# EAGLE design MBHP_Burner (EAGLE 6.4)
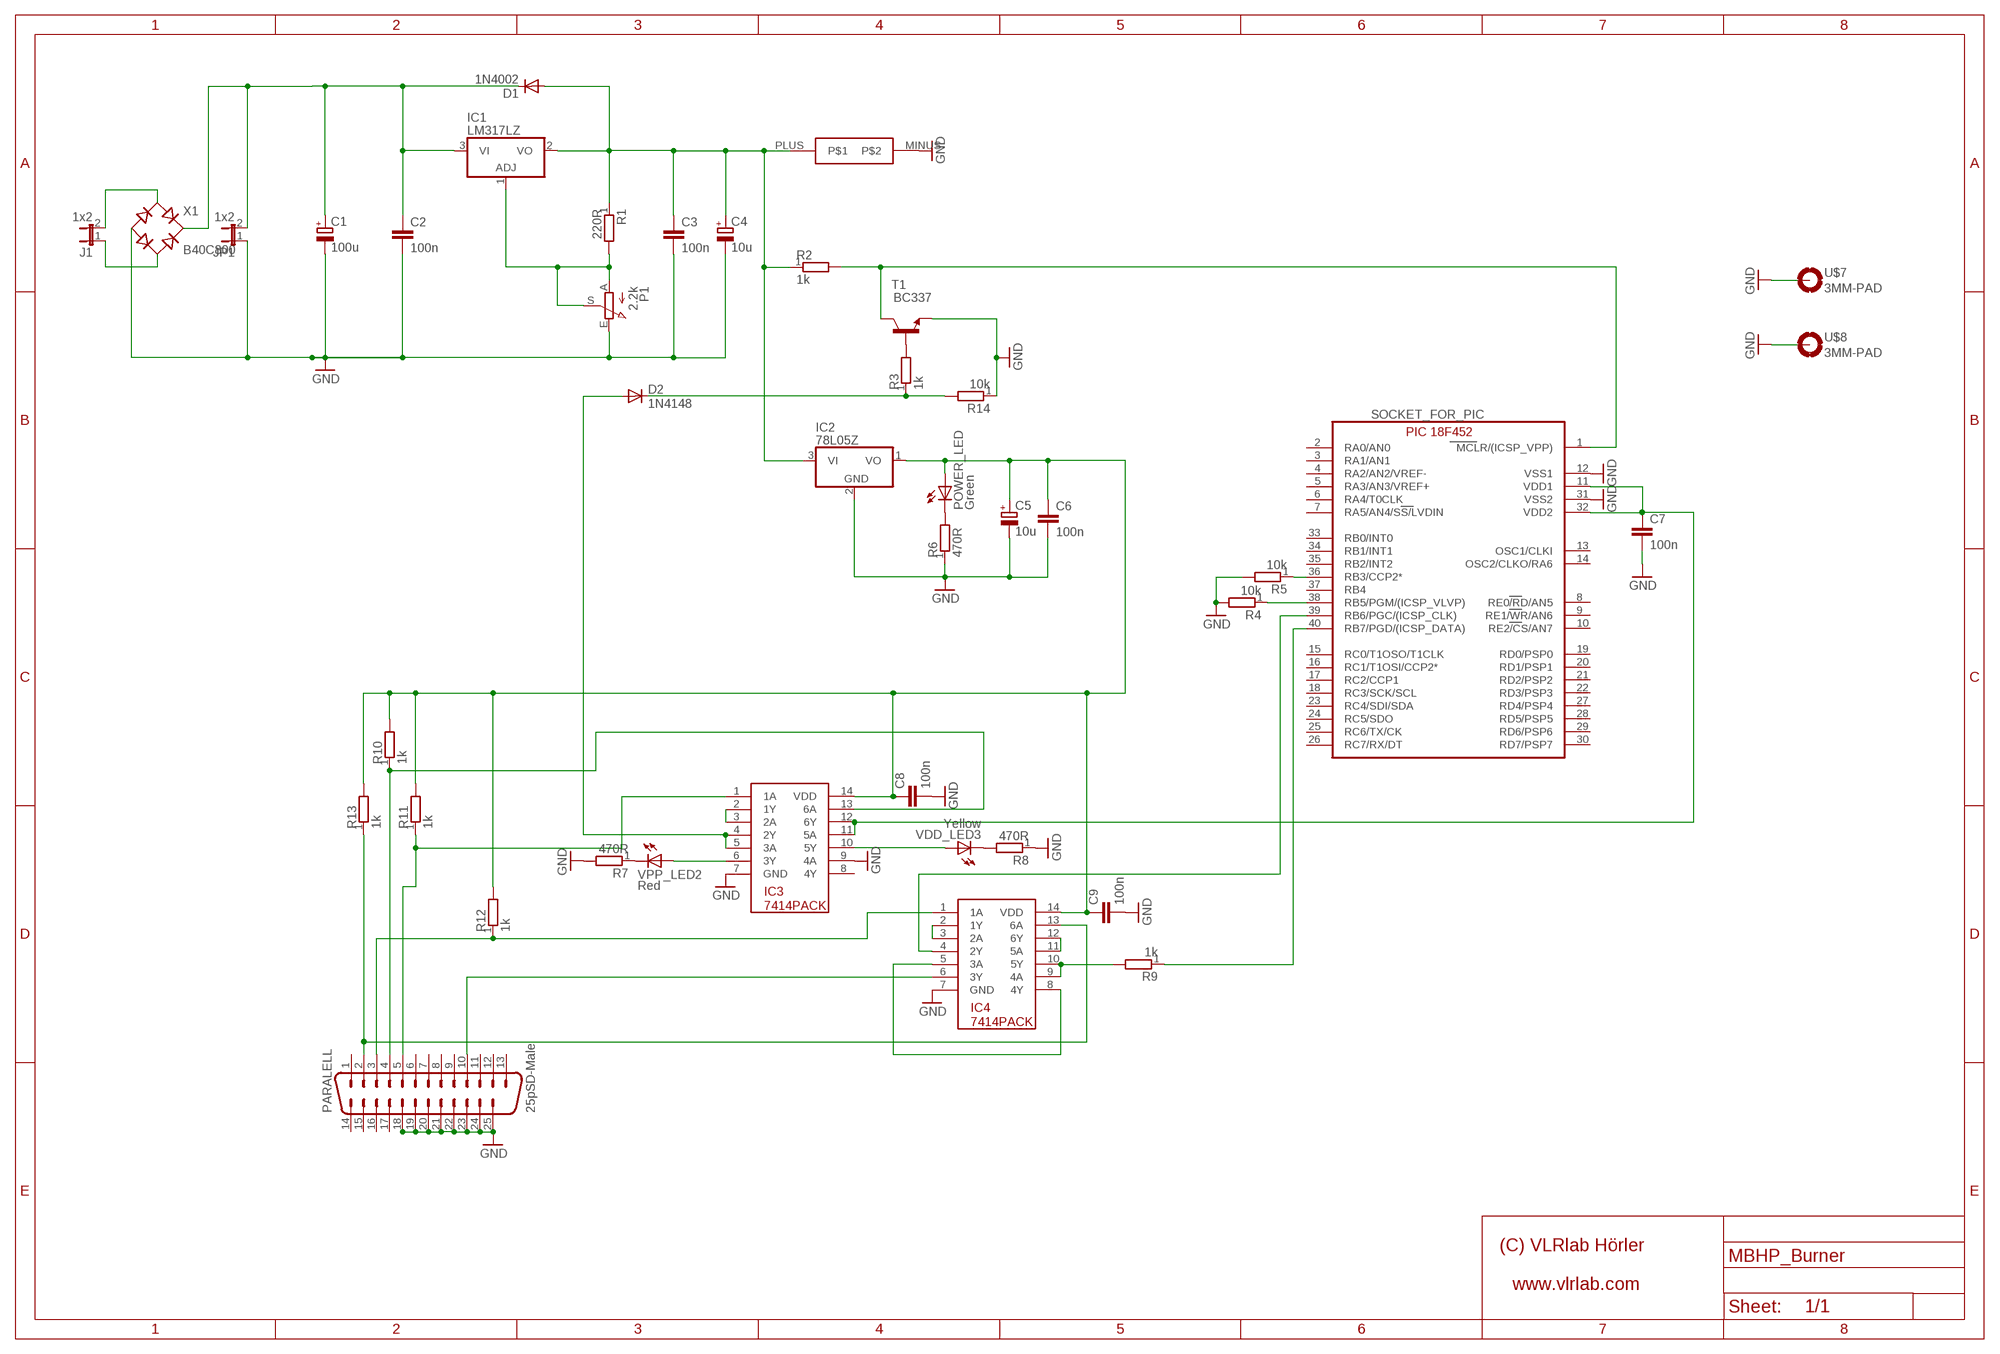
[diagram p0: schematic, sheet 1]

## Parts
C1  100u  CPOL-EUE5-8.5  [E5-8,5]
C2  100n  C5/2.5  [C5B2.5]
C3  100n  C5/2.5  [C5B2.5]
C4  10u  CPOL-EUE2.5-7  [E2,5-7]
C5  10u  CPOL-EUE2.5-7  [E2,5-7]
C6  100n  C5/2.5  [C5B2.5]
C7  100n  C5/2.5  [C5B2.5]
C8  100n  C5/2.5  [C5B2.5]
C9  100n  C5/2.5  [C5B2.5]
D1  1N4002  [D040-10]
D2  1N4148  1N4148DO35-7  [DO35-7]
IC1  LM317LZ  [TO92]
IC2  78L05Z  [TO92]
IC3  7414PACK  [DIL14]
IC4  7414PACK  [DIL14]
J1  1x2  JP1E  [JP1]
J2  MEASUREING-POINT12.5V  [MEASURINGPOINT]
JP1  1x2  JP1E  [JP1]
P1  2.2k  PHIER_6MM  [6MM_V]
PARALELL  25pSD-Male  M25HP  [M25HP]
POWER_LED  Green  LED3MM  [LED3MM]
R1  220R  R  [R-12MM]
R2  1k  R  [R-12MM]
R3  1k  R  [R-12MM]
R4  10k  R  [R-12MM]
R5  10k  R  [R-12MM]
R6  470R  R  [R-12MM]
R7  470R  R  [R-12MM]
R8  470R  R  [R-12MM]
R9  1k  R  [R-12MM]
R10  1k  R  [R-12MM]
R11  1k  R  [R-12MM]
R12  1k  R  [R-12MM]
R13  1k  R  [R-12MM]
R14  10k  R  [R-12MM]
SOCKET_FOR_PIC  PIC18F4X2DIL40  [DIL40]
T1  BC337  [TO92]
U$7  3MM-PAD  [3MM-PAD]
U$8  3MM-PAD  [3MM-PAD]
VDD_LED3  Yellow  LED3MM  [LED3MM]
VPP_LED2  Red  LED3MM  [LED3MM]
X1  B40C800  RB1A  [RB1A]

## Nets
GND: C1.- C2.2 C3.2 C4.- C5.- C6.2 C7.2 C8.2 C9.2 IC2.2(GND) IC3.7(GND) IC3.9(4A) IC4.7(GND) J2.MINUS JP1.1 P1.E PARALELL.18 PARALELL.19 PARALELL.20 PARALELL.21 PARALELL.22 PARALELL.23 PARALELL.24 PARALELL.25 R4.2 R5.2 R6.1 R7.2 R8.1 R14.1 SOCKET_FOR_PIC.12(VSS1) SOCKET_FOR_PIC.31(VSS2) T1.1(E) U$7.B3(MOUNT) U$8.B3(MOUNT) X1.-
N$1: R2.2 SOCKET_FOR_PIC.1(MCLR/(ICSP_VPP)) T1.3(C)
N$2: IC1.1(ADJ) P1.A P1.S R1.2
N$3: POWER_LED.K(C) R6.2
N$4: C3.1 C4.+ D1.A IC1.2(VO) IC2.3(VI) J2.PLUS R1.1 R2.1
N$5: C1.+ C2.1 D1.C IC1.3(VI) JP1.2 X1.+
N$6: IC4.11(5A) IC4.12(6Y)
N$7: R3.2 T1.2(B)
N$8: D2.C R3.1 R14.2
N$9: R5.1 SOCKET_FOR_PIC.36(RB3/CCP2*)
N$10: R4.1 SOCKET_FOR_PIC.38(RB5/PGM/(ICSP_VLVP))
N$11: C5.+ C6.1 C8.1 C9.1 IC2.1(VO) IC3.14(VDD) IC4.14(VDD) POWER_LED.A R10.2 R11.2 R12.2 R13.2
N$12: IC3.13(6A) PARALELL.4 R10.1
N$13: IC4.13(6A) PARALELL.2 R13.1
N$14: IC4.1(1A) PARALELL.3 R12.1
N$15: IC3.1(1A) PARALELL.5 R11.1
N$16: IC3.2(1Y) IC3.3(2A)
N$17: D2.A IC3.4(2Y) IC3.5(3A)
N$18: C7.1 IC3.11(5A) IC3.12(6Y) SOCKET_FOR_PIC.11(VDD1) SOCKET_FOR_PIC.32(VDD2)
N$19: IC3.6(3Y) VPP_LED2.A
N$20: IC3.10(5Y) VDD_LED3.A
N$21: R7.1 VPP_LED2.K(C)
N$22: R8.2 VDD_LED3.K(C)
N$23: IC4.2(1Y) IC4.3(2A)
N$24: IC4.4(2Y) SOCKET_FOR_PIC.39(RB6/PGC/(ICSP_CLK))
N$25: IC4.5(3A) IC4.8(4Y)
N$26: IC4.6(3Y) PARALELL.10
N$27: IC4.9(4A) IC4.10(5Y) R9.2
N$28: R9.1 SOCKET_FOR_PIC.40(RB7/PGD/(ICSP_DATA))
N$29: J1.2 X1.AC1
N$30: J1.1 X1.AC2
Unconnected: IC3.8(4Y) PARALELL.1 PARALELL.6 PARALELL.7 PARALELL.8 PARALELL.9 PARALELL.11 PARALELL.12 PARALELL.13 PARALELL.14 PARALELL.15 PARALELL.16 PARALELL.17 SOCKET_FOR_PIC.2(RA0/AN0) SOCKET_FOR_PIC.3(RA1/AN1) SOCKET_FOR_PIC.4(RA2/AN2/VREF-) SOCKET_FOR_PIC.5(RA3/AN3/VREF+) SOCKET_FOR_PIC.6(RA4/T0CLK) SOCKET_FOR_PIC.7(RA5/AN4/SS/LVDIN) SOCKET_FOR_PIC.8(RE0/RD/AN5) SOCKET_FOR_PIC.9(RE1/WR/AN6) SOCKET_FOR_PIC.10(RE2/CS/AN7) SOCKET_FOR_PIC.13(OSC1/CLKI) SOCKET_FOR_PIC.14(OSC2/CLKO/RA6) SOCKET_FOR_PIC.15(RC0/T1OSO/T1CLK) SOCKET_FOR_PIC.16(RC1/T1OSI/CCP2*) SOCKET_FOR_PIC.17(RC2/CCP1) SOCKET_FOR_PIC.18(RC3/SCK/SCL) SOCKET_FOR_PIC.19(RD0/PSP0) SOCKET_FOR_PIC.20(RD1/PSP1) SOCKET_FOR_PIC.21(RD2/PSP2) SOCKET_FOR_PIC.22(RD3/PSP3) SOCKET_FOR_PIC.23(RC4/SDI/SDA) SOCKET_FOR_PIC.24(RC5/SDO) SOCKET_FOR_PIC.25(RC6/TX/CK) SOCKET_FOR_PIC.26(RC7/RX/DT) SOCKET_FOR_PIC.27(RD4/PSP4) SOCKET_FOR_PIC.28(RD5/PSP5) SOCKET_FOR_PIC.29(RD6/PSP6) SOCKET_FOR_PIC.30(RD7/PSP7) SOCKET_FOR_PIC.33(RB0/INT0) SOCKET_FOR_PIC.34(RB1/INT1) SOCKET_FOR_PIC.35(RB2/INT2) SOCKET_FOR_PIC.37(RB4)

## Library data of the parts
C1 C4 C5 = rcl:CPOL-EU: POLARIZED CAPACITOR, European symbol
C2 C3 C6-C9 = capacitor-wima:C: CAPACITOR naming: grid - package width
D1 = Diode 1N4002:1N4002
D2 = diode:1N4148: DIODE high speed (Philips)
IC1 = linear:*317: Positive VOLTAGE REGULATOR
IC2 = linear:78*: Positive VOLTAGE REGULATOR Source: http://cache.national.com/ds/LM/LM78L05.pdf http://www.fairchildsemi.com/ds/LM/LM7805.pdf
IC3 IC4 = 74xx-eu:74*14PACK: Hex schmitt trigger INVERTER
J1 JP1 = Jumper:JP1E: JUMPER
J2 = Jumper:MEASUREING-POINT
P1 = Potentiometer 6mm:PHIER_6MM
PARALELL = con-subd:M25: SUB-D; OC_FARNELL: unknown; OC_NEWARK: unknown
POWER_LED VDD_LED3 VPP_LED2 = led:LED: LED OSRAM: - CHIPLED LG R971, LG N971, LY N971, LG Q971, LY Q971, LO R971, LY R971 LH N974, LH R974 LS Q976, LO Q976, LY Q976 LO Q996 - Hyper CHIPLED LW Q18S LB Q993, LB Q99A, LB R99A - SideLED LS A670, LO A670, LY A670, LG A670, LP A670 LB A673, LV A673, LT A673, LW A673 LH A674 LY A675 LS A676, LA A676, LO A676, LY A676, LW A676 LS A679, LY A679, LG A679 - Hyper Micro SIDELED® LS Y876, LA Y876, LO Y876, LY Y876 LT Y87S - SmartLED LW L88C, LW L88S LB L89C, LB L89S, LG L890 LS L89K, LO L89K, LY L89K LS L896, LA L896, LO L896, LY L896 - TOPLED LS T670, LO T670, LY T670, LG T670, LP T670 LSG T670, LSP T670, LSY T670, LOP T670, LYG T670 LG T671, LOG T671, LSG T671 LB T673, LV T673, LT T673, LW T673 LH T674 LS T676, LA T676, LO T676, LY T676, LB T676, LH T676, LSB T676, LW T676 LB T67C, LV T67C, LT T67C, LS T67K, LO T67K, LY T67K, LW E67C LS E67B, LA E67B, LO E67B, LY E67B, LB E67C, LV E67C, LT E67C LW T67C LS T679, LY T679, LG T679 LS T770, LO T770, LY T770, LG T770, LP T770 LB T773, LV T773, LT T773, LW T773 LH T774 LS E675, LA E675, LY E675, LS T675 LS T776, LA T776, LO T776, LY T776, LB T776 LHGB T686 LT T68C, LB T68C - Hyper Mini TOPLED® LB M676 - Mini TOPLED Santana® LG M470 LS M47K, LO M47K, LY M47K Source: http://www.osram.convergy.de LUXEON: - LUMILED® LXK2-PW12-R00, LXK2-PW12-S00, LXK2-PW14-U00, LXK2-PW14-V00 LXK2-PM12-R00, LXK2-PM12-S00, LXK2-PM14-U00 LXK2-PE12-Q00, LXK2-PE12-R00, LXK2-PE12-S00, LXK2-PE14-T00, LXK2-PE14-U00 LXK2-PB12-K00, LXK2-PB12-L00, LXK2-PB12-M00, LXK2-PB14-N00, LXK2-PB14-P00, LXK2-PB14-Q00 LXK2-PR12-L00, LXK2-PR12-M00, LXK2-PR14-Q00, LXK2-PR14-R00 LXK2-PD12-Q00, LXK2-PD12-R00, LXK2-PD12-S00 LXK2-PH12-R00, LXK2-PH12-S00 LXK2-PL12-P00, LXK2-PL12-Q00, LXK2-PL12-R00 Source: www.luxeon.com KINGBRIGHT: KA-3528ASYC Source: www.kingbright.com
R1-R14 = R:R
SOCKET_FOR_PIC = pic18f452:PIC18F4X2: Pic Microcontroller
T1 = transistor:BC337: NPN TRANSISTOR
U$7 U$8 = holes_Ivan:3MM-PAD
X1 = rectifier:RB1A: RECTIFIER 1 A

## Board
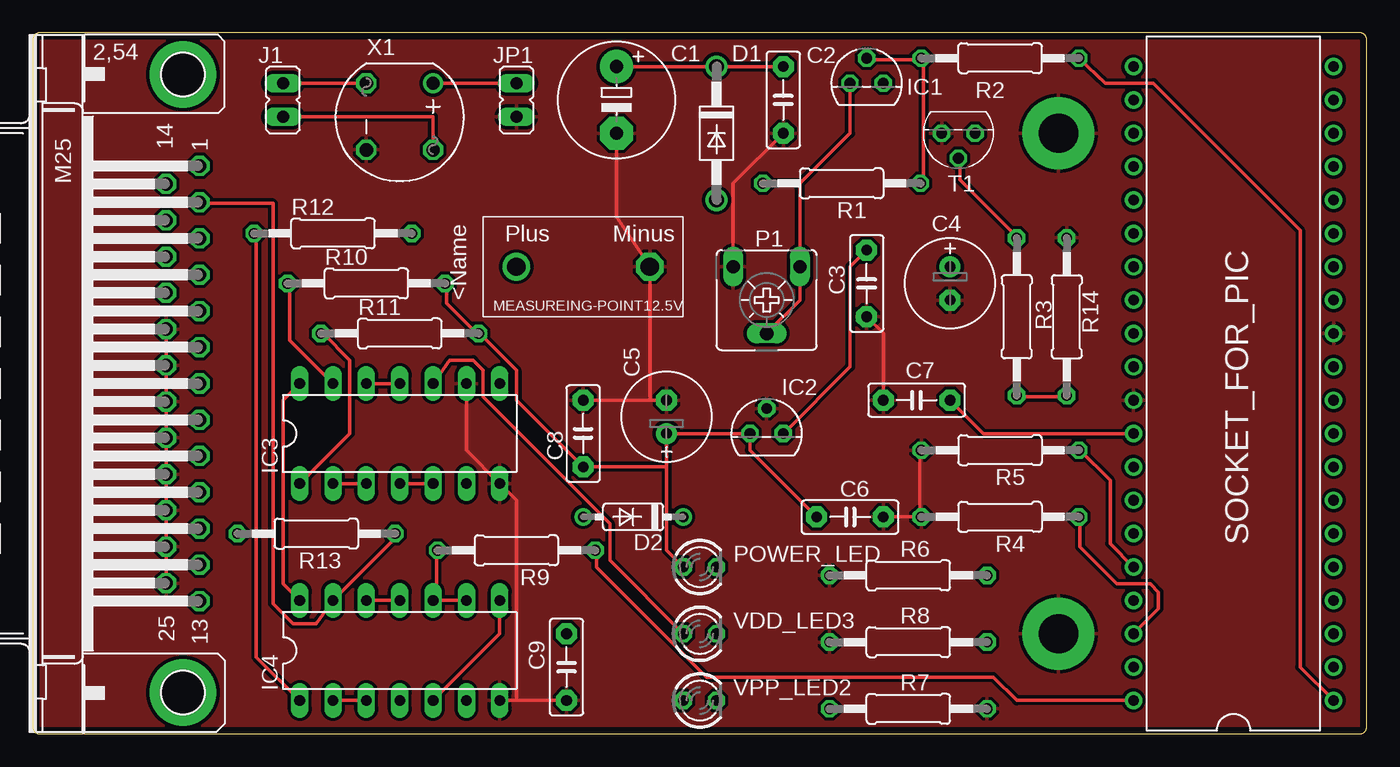
[diagram p1: board, top side]
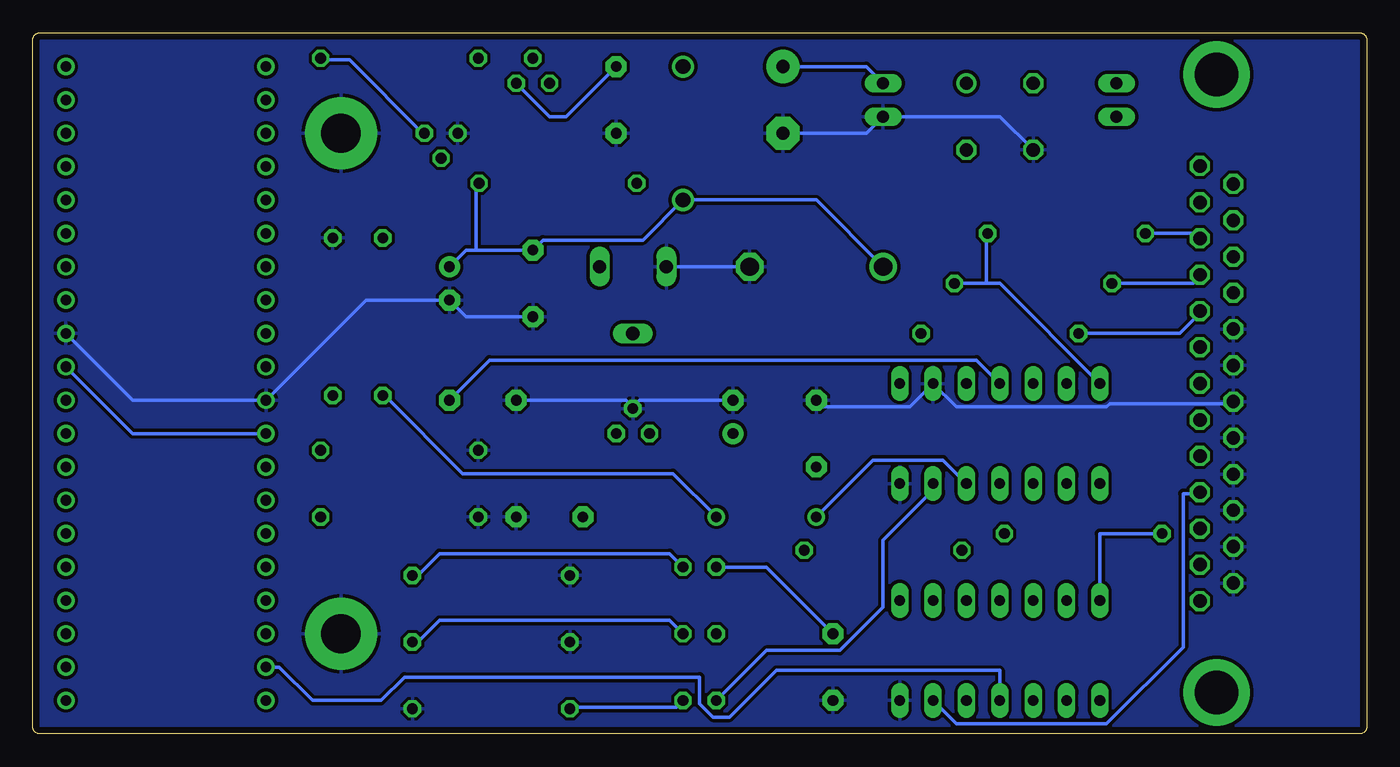
[diagram p2: board, bottom side, seen from below]

Size 101.58 x 53.37 mm. Coordinates in mm from the lower left corner, seen from the top.
Outline: 0,52.86 0,0.51 arc90 0.51,0 101.07,0 arc90 101.58,0.51 101.58,52.86 arc90 101.07,53.37 0.51,53.37 arc90 0,52.86
Copper layers (1*16): Top 0.035mm / dielectric 1.5mm / Bottom 0.035mm
Design rules "makePCB *": minimum track width 10mil, minimum drill 24mil, track to track 10mil, track to pad 10mil, pad to pad 10mil, via to via 10mil, smd to smd 8mil, copper to edge 20mil, drill to drill 12mil, minimum pad ring 10mil, minimum via ring 8mil, stop-mask expansion 4mil, vias tented up to drill 0mil, thermal gap 10mil

### Footprints (pad centres in the part's own frame; a part is rotated, then mirrored left to right if it is on the bottom)
E5-8,5 = drill 1.016 pad 2.54: + -2.54,0 | drill 1.016 pad 2.54 octagon: - 2.54,0
C5B2.5 = drill 0.813 pad 1.6 octagon: 1 -2.54,0; 2 2.54,0
E2,5-7 = drill 0.813 pad 1.6: + -1.27,0 | drill 0.813 pad 1.6 octagon: - 1.27,0
D040-10 = drill 1.118: A 5.08,0; C -5.08,0
DO35-7 = drill 0.813: A 3.81,0; C -3.81,0
TO92 = drill 0.813 octagon: 1 -1.27,0; 2 0,1.905; 3 1.27,0
DIL14 = drill 0.813 long: 1 -7.62,-3.81; 2 -5.08,-3.81; 3 -2.54,-3.81; 4 0,-3.81; 5 2.54,-3.81; 6 5.08,-3.81; 7 7.62,-3.81; 8 7.62,3.81; 9 5.08,3.81; 10 2.54,3.81; 11 0,3.81; 12 -2.54,3.81; 13 -5.08,3.81; 14 -7.62,3.81
JP1 = drill 0.914 long: 1 0,-1.27; 2 0,1.27
MEASURINGPOINT = drill 1.4 octagon: MINUS 0,-5.08 | drill 1.4: PLUS 0,5.08
6MM_V = drill 1.016 long: A -2.54,-2.54; E 2.54,-2.54; S 0,2.54
M25HP = drill 1.016 octagon: 1 -16.561,1.27; 2 -13.792,1.27; 3 -11.049,1.27; 4 -8.28,1.27; 5 -5.512,1.27; 6 -2.769,1.27; 7 0,1.27; 8 2.769,1.27; 9 5.512,1.27; 10 8.28,1.27; 11 11.049,1.27; 12 13.792,1.27; 13 16.561,1.27; 14 -15.189,-1.27; 15 -12.421,-1.27; 16 -9.652,-1.27; 17 -6.909,-1.27; 18 -4.14,-1.27; 19 -1.372,-1.27; 20 1.372,-1.27; 21 4.14,-1.27; 22 6.909,-1.27; 23 9.652,-1.27; 24 12.421,-1.27; 25 15.189,-1.27 | drill 3.302 pad 5.08: G1 -23.52,0; G2 23.52,0
LED3MM = drill 0.813 octagon: A -1.27,0; K 1.27,0
R-12MM = drill 0.813 octagon: 1 -6,0; 2 6,0
DIL40 = drill 0.813: 1 -24.13,-7.62; 2 -21.59,-7.62; 3 -19.05,-7.62; 4 -16.51,-7.62; 5 -13.97,-7.62; 6 -11.43,-7.62; 7 -8.89,-7.62; 8 -6.35,-7.62; 9 -3.81,-7.62; 10 -1.27,-7.62; 11 1.27,-7.62; 12 3.81,-7.62; 13 6.35,-7.62; 14 8.89,-7.62; 15 11.43,-7.62; 16 13.97,-7.62; 17 16.51,-7.62; 18 19.05,-7.62; 19 21.59,-7.62; 20 24.13,-7.62; 21 24.13,7.62; 22 21.59,7.62; 23 19.05,7.62; 24 16.51,7.62; 25 13.97,7.62; 26 11.43,7.62; 27 8.89,7.62; 28 6.35,7.62; 29 3.81,7.62; 30 1.27,7.62; 31 -1.27,7.62; 32 -3.81,7.62; 33 -6.35,7.62; 34 -8.89,7.62; 35 -11.43,7.62; 36 -13.97,7.62; 37 -16.51,7.62; 38 -19.05,7.62; 39 -21.59,7.62; 40 -24.13,7.62
TO92' = drill 0.813 octagon: 1 1.27,0; 2 0,1.905; 3 -1.27,0
3MM-PAD = drill 3 pad 5.5: B3 0,0
RB1A = drill 1.016: + -2.54,2.54 | drill 1.016 octagon: - 2.54,-2.54; AC1 2.54,2.54; AC2 -2.54,-2.54

### Placement (x,y rotation side)
C1  44.45,48.26 270 top
C2  57.15,48.26 270 top
C3  63.5,34.29 270 top
C4  69.85,34.29 270 top
C5  48.26,24.13 90 top
C6  62.23,16.51 0 top
C7  67.31,25.4 180 top
C8  41.91,22.86 90 top
C9  40.64,5.08 270 top
D1  52.07,45.72 270 top
D2  45.72,16.51 180 top
IC1  63.5,49.53 0 top
IC2  55.88,22.86 0 top
IC3  27.94,22.86 0 top
IC4  27.94,6.35 0 top
J1  19.05,48.26 180 top
J2  41.91,35.56 90 top
JP1  36.83,48.26 0 top
P1  55.88,33.02 180 top
PARALELL  11.43,26.67 270 top
POWER_LED  50.8,12.7 0 top
R1  61.59,41.91 180 top
R2  73.66,51.44 0 top
R3  74.93,31.75 90 top
R4  73.66,16.51 180 top
R5  73.66,21.59 180 top
R6  66.67,12.07 0 top
R7  66.67,1.91 0 top
R8  66.67,6.99 0 top
R9  36.83,13.97 180 top
R10  25.4,34.29 0 top
R11  27.94,30.48 0 top
R12  22.86,38.1 0 top
R13  21.59,15.24 180 top
R14  78.74,31.75 270 top
SOCKET_FOR_PIC  91.44,26.67 90 top
T1  BC337  [TO92']  70.48,45.72 180 top
U$2  [VLRLAB]  48.9,41.27 180 top
U$3  [VLRLAB]  3.17,39.37 270 bottom
U$4  [MBHP_BURNER]  91.44,40.01 270 bottom
U$5  [(C)T.KLOSE]  90.17,11.43 90 bottom
U$6  [(C)T.KLOSE]  38.1,41.91 0 top
U$7  78.11,45.72 0 top
U$8  78.11,7.62 0 top
VDD_LED3  50.8,7.62 0 top
VPP_LED2  50.8,2.54 0 top
X1  27.94,46.99 270 top

### Tracks (layer width: path | path; a pad name or v marks a point on that pad's centre or on a via)
GND
  Top 0.254: PARALELL.18 10.16,30.73 10.16,28.19 PARALELL.19 10.16,27.94 10.16,25.4 PARALELL.20 10.16,25.15 10.16,22.61 PARALELL.21 10.16,22.35 10.16,19.81 PARALELL.22 10.16,19.56 PARALELL.23 10.16,14.48 PARALELL.24 10.16,14.22 10.16,11.68 PARALELL.25 | C9.2 36.83,2.54 | 36.83,2.54 IC4.7 | IC3.9 33.02,21.59 IC3.7 36.83,17.78 36.83,2.54 | C2.2 53.34,41.91 P1.E | C1.- 44.45,39.37 J2.MINUS 46.99,25.4 | C5.- 46.99,25.4 | 46.99,25.4 C8.2 | C6.2 67.56,16.51 | 67.56,16.51 R4.2 67.56,16.51 | 67.56,16.51 67.56,21.59 R5.2 | C3.2 64.77,30.48 C7.2
  Bottom 0.254: PARALELL.20 10.16,25.15 19.56,25.15 19.81,24.89 31.24,24.89 IC3.9 34.8,24.89 41.4,24.89 C8.2 | P1.E 52.07,35.56 J2.MINUS | C1.- 38.1,45.72 JP1.1 27.94,46.99 X1.- | 55.88,24.89 55.37,25.4 C5.- | 55.88,24.89 IC2.2 55.88,24.89 | 55.88,24.89 56.39,25.4 C7.2 | C3.2 68.58,31.75 C4.- 76.2,33.02 SOCKET_FOR_PIC.31 93.98,25.4 SOCKET_FOR_PIC.12
  pour Bottom: 0,53.34 101.6,53.34 101.6,0 0,0
  pour Top: 0,53.34 101.6,53.34 101.6,0 0,0
N$1
  Top 0.254: SOCKET_FOR_PIC.1 96.52,5.08 96.52,38.35 85.34,49.53 81.66,49.53 R2.2
  Bottom 0.254: T1.3 71.88,45.72 77.47,51.31 79.5,51.31 R2.2
N$2
  Top 0.254: 58.42,41.91 62.23,45.72 IC1.1 | 58.42,41.91 58.42,38.61 P1.A 58.42,33.02 P1.S | 58.42,41.91 55.63,41.91 R1.2
N$3
  Bottom 0.254: POWER_LED.K 53.09,13.72 70.61,13.72 72.14,12.19 72.64,12.19 R6.2
N$4
  Top 0.254: 67.56,51.44 66.93,51.31 63.5,51.31 IC1.2 | 67.56,51.44 R2.1 | IC2.3 62.23,27.94 62.23,35.56 C3.1 | 67.56,51.44 R2.1 | R1.1 67.82,41.91 67.82,50.8 R2.1
  Bottom 0.254: C4.+ 68.58,36.83 67.82,36.83 | 67.82,36.83 C3.1 62.74,37.59 55.12,37.59 D1.A 41.91,40.64 J2.PLUS | 67.82,36.83 67.82,41.91 R1.1
N$5
  Top 0.254: X1.+ JP1.2 | C2.1 D1.C C1.+
  Bottom 0.254: JP1.2 38.1,50.8 C1.+ | IC1.3 62.23,46.99 60.96,46.99 C2.1
N$6
  Top 0.254: IC4.11 IC4.12
N$7
  Top 0.254: R3.2 74.93,37.85 70.61,42.16 70.61,43.69 T1.2
N$8
  Top 0.254: R14.2 78.74,25.65 74.93,25.65 R3.1
  Bottom 0.254: D2.C 52.83,19.81 68.83,19.81 74.68,25.65 74.93,25.65 R3.1
N$9
  Top 0.254: SOCKET_FOR_PIC.36 82.04,14.48 82.04,19.3 79.76,21.59 R5.1
N$10
  Top 0.254: R4.1 79.76,16.51 79.76,14.22 82.55,11.43 85.09,11.43 85.72,10.8 85.72,9.52 SOCKET_FOR_PIC.38
N$11
  Top 0.254: POWER_LED.A 48.26,13.97 48.26,20.32 | 48.26,20.32 C5.+ IC2.1 54.61,21.59 C6.1 | 48.26,20.32 C8.1 36.83,25.4 36.83,27.69 34.04,30.48 R11.2 33.78,30.48 31.5,32.77 31.5,34.29 R10.2 | IC4.14 19.05,11.43 19.05,25.4 IC3.14
  Bottom 0.254: C9.1 45.72,12.7 POWER_LED.A | IC4.14 20.32,15.24 15.75,15.24 R13.2 | IC3.14 27.94,34.29 28.96,34.29 | 28.96,34.29 31.24,34.29 R10.2 | 28.96,34.29 28.96,38.1 R12.2
N$12
  Top 0.254: IC3.13 19.56,29.97 19.56,34.29 R10.1
  Bottom 0.254: PARALELL.4 12.7,34.8 13.21,34.29 19.3,34.29 R10.1
N$13
  Top 0.254: R13.1 27.43,15.24 27.43,14.73 IC4.13 21.59,8.38 19.81,8.38 18.29,9.91 18.29,40.39 12.7,40.39 PARALELL.2
N$14
  Top 0.254: IC4.1 17.02,5.84 17.02,38.1 R12.1
  Bottom 0.254: PARALELL.3 12.7,37.85 12.95,38.1 16.76,38.1 R12.1
N$15
  Top 0.254: IC3.1 24.13,22.86 24.13,28.45 22.1,30.48 R11.1
  Bottom 0.254: PARALELL.5 12.7,32 14.22,30.48 21.84,30.48 R11.1
N$16
  Top 0.254: IC3.3 IC3.2
N$17
  Top 0.254: IC3.5 IC3.4
  Bottom 0.254: D2.A 37.59,20.83 32.26,20.83 IC3.5
N$18
  Top 0.254: IC3.11 IC3.12 | SOCKET_FOR_PIC.32 72.39,22.86 C7.1
  Bottom 0.254: IC3.11 29.72,28.45 66.8,28.45 C7.1 | SOCKET_FOR_PIC.11 93.98,22.86 SOCKET_FOR_PIC.32
N$19
  Bottom 0.254: VPP_LED2.A 45.72,6.35 40.13,6.35 36.83,9.65 36.83,14.73 33.02,18.54 IC3.6
N$20
  Top 0.254: VDD_LED3.A 43.94,13.21 43.94,16 34.29,25.65 34.29,27.69 33.53,28.45 31.75,28.45 IC3.10
N$21
  Bottom 0.254: VPP_LED2.K 52.58,2.03 60.45,2.03 R7.1
N$22
  Bottom 0.254: VDD_LED3.K 53.09,8.64 70.61,8.64 72.14,7.11 72.64,7.11 R8.2
N$23
  Top 0.254: IC4.3 IC4.2
N$24
  Bottom 0.254: IC4.4 27.94,4.83 44.96,4.83 48.51,1.27 49.78,1.27 50.8,2.29 50.8,4.32 73.28,4.32 75.06,2.54 80.26,2.54 82.8,5.08 SOCKET_FOR_PIC.39
N$25
  Top 0.254: IC4.5 35.56,7.62 IC4.8
N$26
  Bottom 0.254: IC4.6 31.24,0.76 19.81,0.76 13.97,6.6 13.97,18.29 12.7,18.29 PARALELL.10
N$27
  Top 0.254: IC4.9 30.73,10.16 | 30.73,10.16 IC4.10 30.73,10.16 | 30.73,10.16 30.73,13.97 R9.2
N$28
  Top 0.254: SOCKET_FOR_PIC.40 74.93,2.54 73.15,4.32 51.31,4.32 42.93,12.7 42.93,13.97 R9.1
N$29
  Top 0.254: J1.2 30.48,46.99 X1.AC1
N$30
  Top 0.254: X1.AC2 J1.1